# Altium schematic sheet GSM-Board.SchDoc
size A4; SheetNumber: 3; SheetTotal: 3
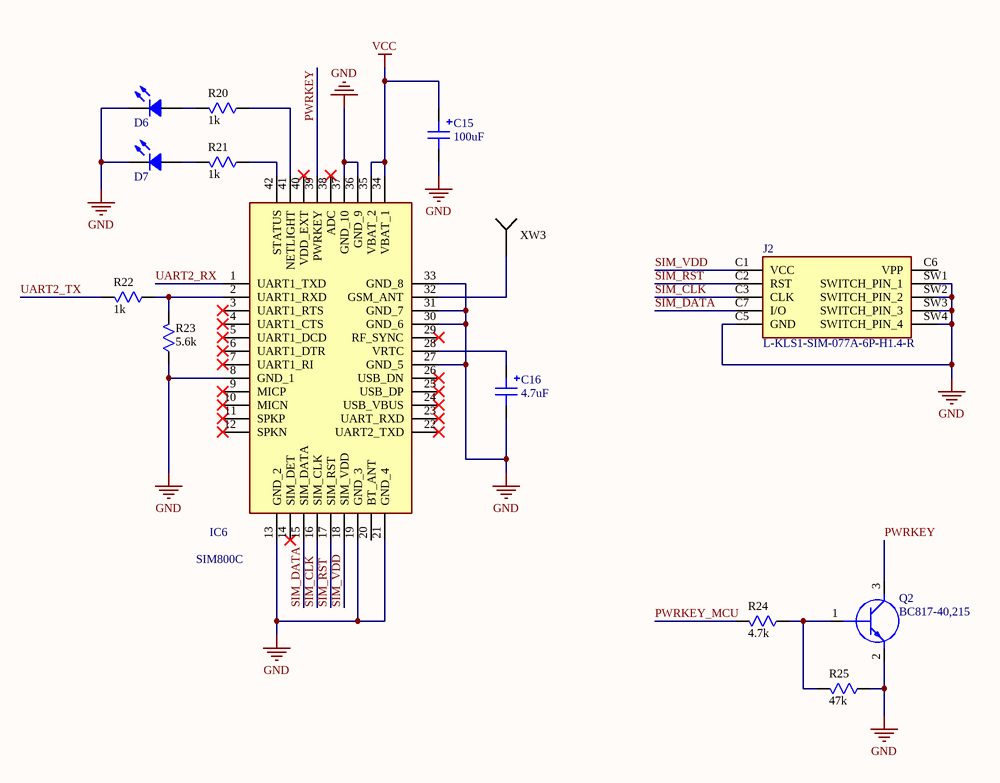
[diagram p0: GSM-Board.SchDoc]

## Parts
C15  100uF  [CAP: TANTAL-D]
C16  4.7uF  [CAP: TANTAL-A]
D6  (no value)  [LED0805]
D7  (no value)  [LED0805]
IC6  SIM800C  [SIM800C]
J2  L-KLS1-SIM-077A-6P-H1.4-R  [LKLS1SIM077A6PH14R]
Q2  BC817-40,215  [BC81740215]
R20  value 1k  [RES: 0805]
R21  value 1k  [RES: 0805]
R22  value 1k  [RES: 0805]
R23  value 5.6k  [RES: 0805]
R24  value 4.7k  [RES: 0805]
R25  value 47k  [RES: 0805]
XW3  (no value)  [CON: SMA EDGE MOUNT]

## Nets
GND: C15.2 C16.2 D6.2 D7.2 IC6.8(GND_1) IC6.13(GND_2) IC6.19(GND_3) IC6.21(GND_4) IC6.27(GND_5) IC6.30(GND_6) IC6.31(GND_7) IC6.33(GND_8) IC6.36(GND_9) IC6.37(GND_10) J2.C5(GND) J2.SW1(SWITCH_PIN_1) J2.SW2(SWITCH_PIN_2) J2.SW3(SWITCH_PIN_3) J2.SW4(SWITCH_PIN_4) Q2.2(E) R23.1 R25.1
VCC: C15.1 IC6.34(VBAT_1) IC6.35(VBAT_2)
PWRKEY: IC6.39(PWRKEY) Q2.3(C)
PWRKEY_MCU: R24.2
SIM_CLK: IC6.16(SIM_CLK) J2.C3(CLK)
SIM_DATA: IC6.15(SIM_DATA) J2.C7(I/O)
SIM_RST: IC6.17(SIM_RST) J2.C2(RST)
SIM_VDD: IC6.18(SIM_VDD) J2.C1(VCC)
UART2_RX: IC6.1(UART1_TXD)
UART2_TX: R22.2
NetC16_1: C16.1 IC6.28(VRTC)
NetD6_1: D6.1 R20.2
NetD7_1: D7.1 R21.2
NetIC6_2: IC6.2(UART1_RXD) R22.1 R23.2
NetIC6_32: IC6.32(GSM_ANT) XW3.1(SIG)
NetIC6_41: IC6.41(NETLIGHT) R20.1
NetIC6_42: IC6.42(STATUS) R21.1
NetQ2_1: Q2.1(B) R24.1 R25.2

Not connected (* = marked no-connect by the designer): IC6 3(UART1_RTS)* 4(UART1_CTS)* 5(UART1_DCD)* 6(UART1_DTR)* 7(UART1_RI)* 9(MICP)* 10(MICN)* 11(SPKP)* 12(SPKN)* 14(SIM_DET)* 20(BT_ANT) 22(UART2_TXD)* 23(UART_RXD)* 24(USB_VBUS)* 25(USB_DP)* 26(USB_DN)* 29(RF_SYNC)* 38(ADC)* 40(VDD_EXT)*; J2 C6(VPP)

## Library data of the parts
C15 C16 = Capacitor_polar: SMD Capacitor Polar
D6 D7 = LED: Chip LED
IC6 = -SIM800C: Integrated Circuit; Manufacturer_Name: SIMCOM; Datasheet Link: https://datasheet.lcsc.com/szlcsc/SIMCom-Wireless-Solutions-SIM800C-24Mbit_C69119.pdf; Manufacturer_Part_Number: -SIM800C
J2 = L-KLS1-SIM-077A-6P-H1.4-R: Connector; Manufacturer_Name: KLS Electronic; Datasheet Link: http://www.klsele.com/admin/product_upload/20190123112744L-KLS1-SIM-077A-6P-H1.4-R--.pdf; Height: 1.45mm; Manufacturer_Part_Number: L-KLS1-SIM-077A-6P-H1.4-R
Q2 = BC817-40,215: Transistor BJT NPN; Manufacturer_Name: Nexperia; Datasheet Link: https://assets.nexperia.com/documents/data-sheet/BC817_SER.pdf; Height: 1.1mm; Manufacturer_Part_Number: BC817-40,215; Mouser Part Number: 771-BC817-40-T/R; Mouser Price/Stock: https://www.mouser.co.uk/ProductDetail/Nexperia/BC817-40215?qs=me8TqzrmIYU%252B245p8hOLaQ%3D%3D; Arrow Part Number: BC817-40,215; Arrow Price/Stock: https://www.arrow.com/en/products/bc817-40215/nexperia?region=nac
R20-R25 = Resistor: Manufacturer: Yageo; PartNumber: RC0201JR-07100RL; TypeResistor: Resistor film; Power: 0.05W; Package: 0201; HelpURL: https://www.digikey.com/product-detail/en/yageo/RC0201JR-07100RL/311-100NCT-ND/1949006; ValueManufacturerPartNumber: =TypeResistor+', '+Value+', '+Tolerance+', '+Package+', '+Power+', '+Temperature; Temperature: -55...+125°C
XW3 = Connector RF